# Altium project 3DAS_4Camera.PrjPcb (part 9 of 10)

## Sheet [15] 2ND_AP1302 ISP.SchDoc
size A3; DocumentNumber: 15; SheetNumber: 15; SheetTotal: 16
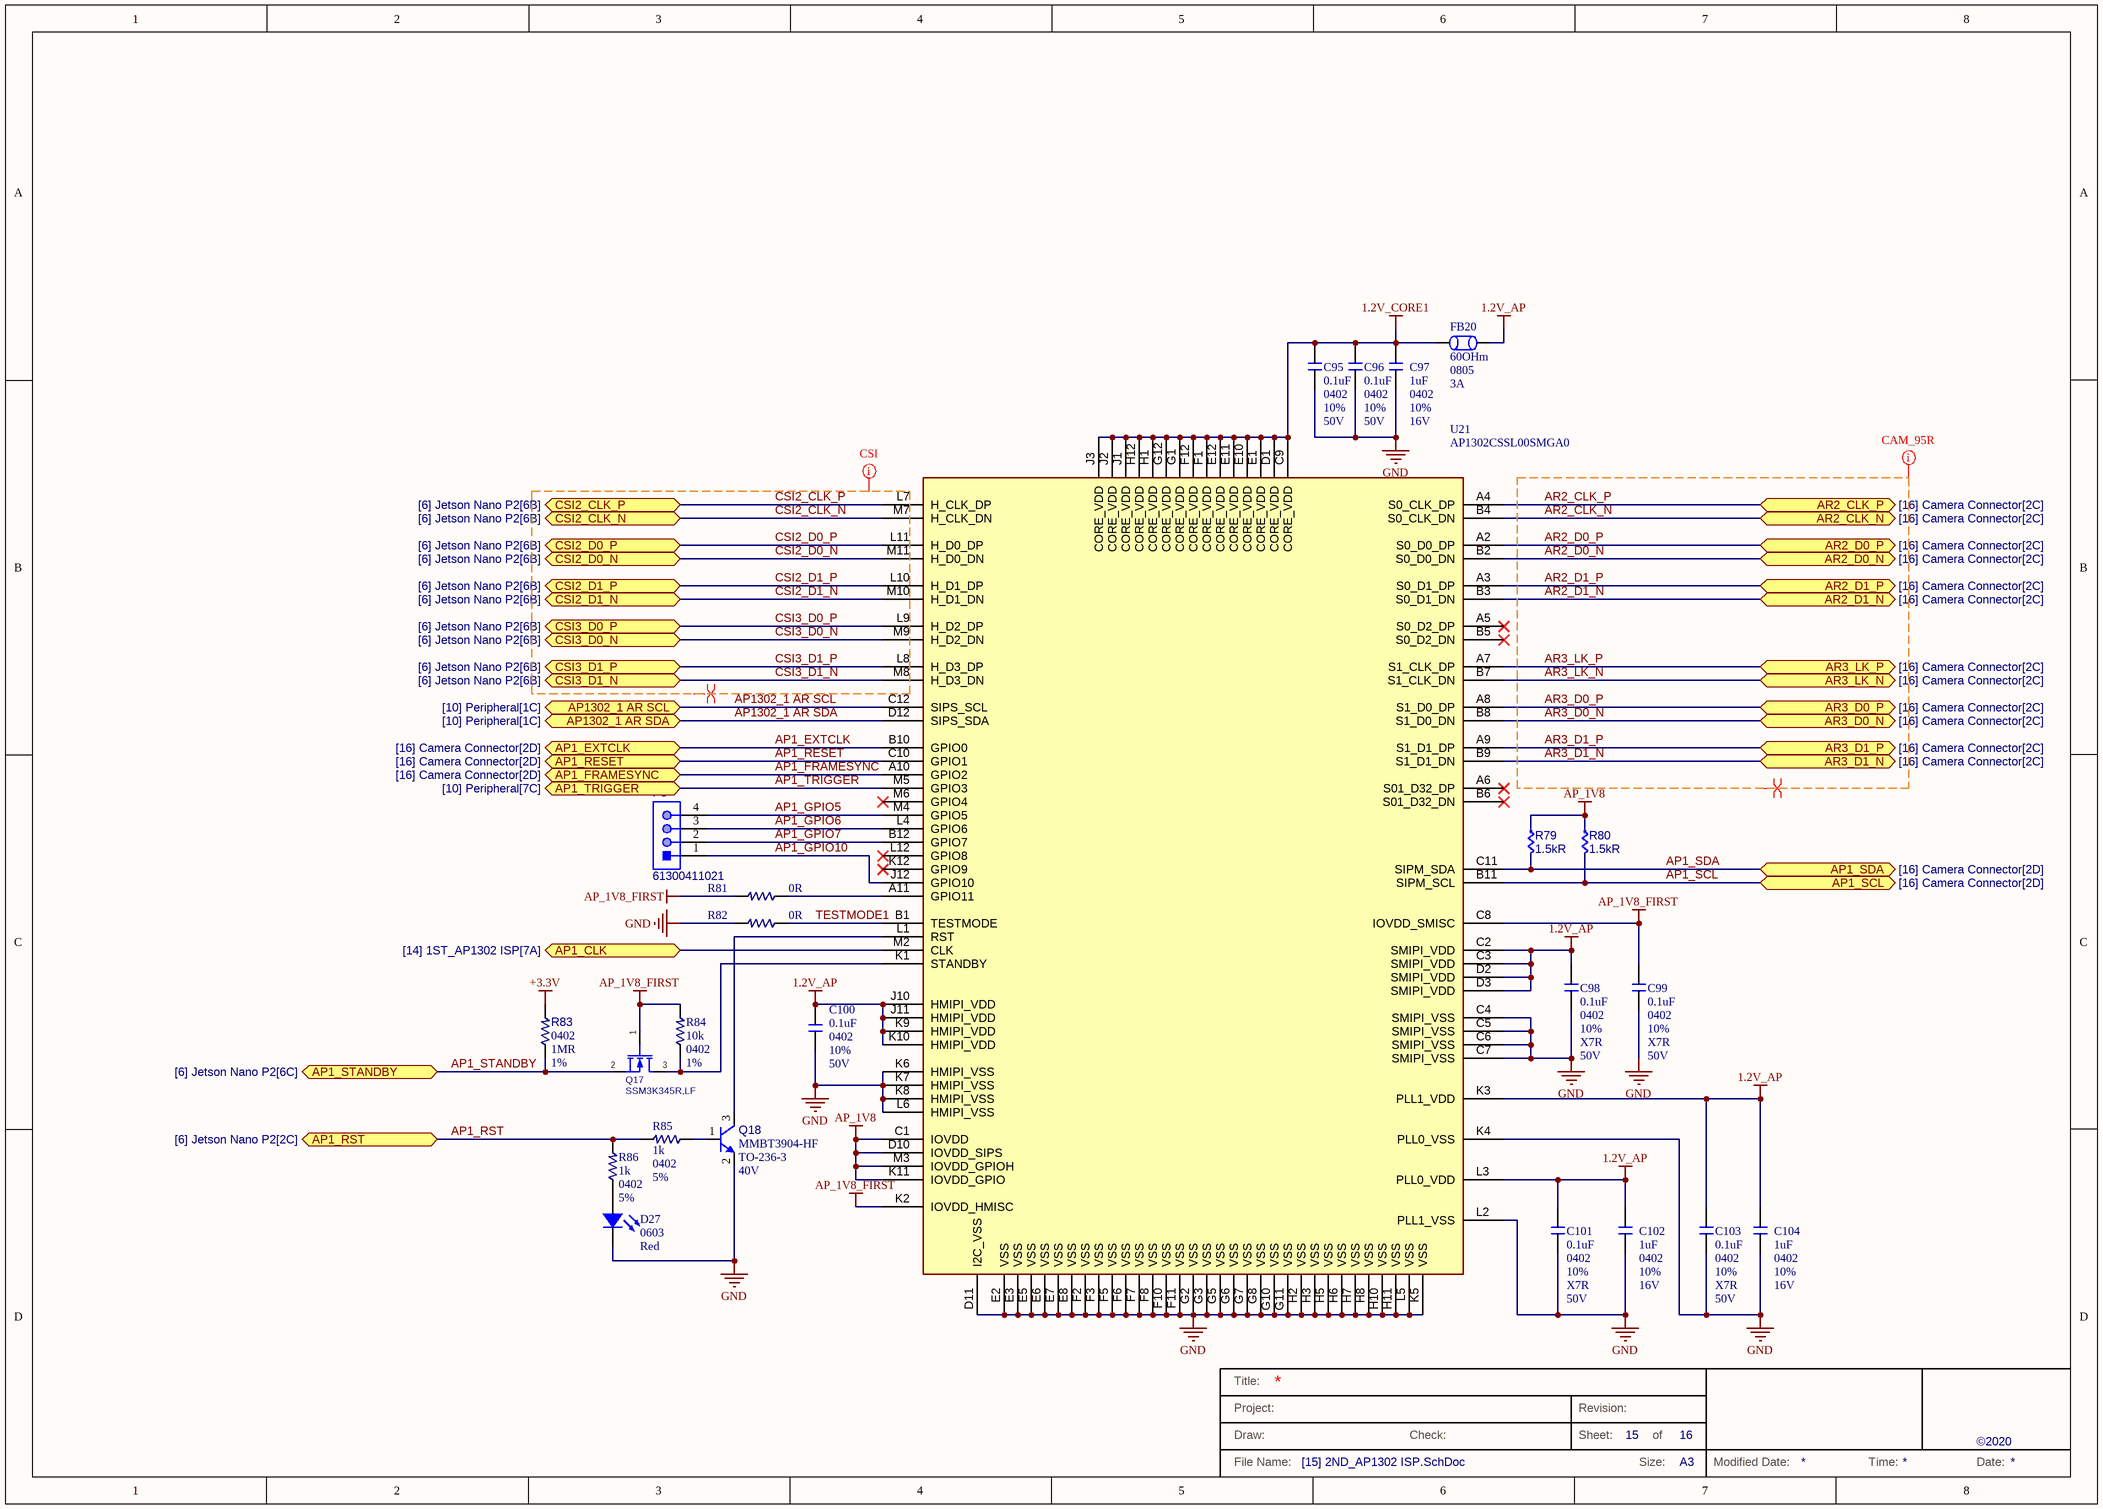
[diagram p14: [15] 2ND_AP1302 ISP.SchDoc]

### Parts
C95  0.1uF  Case/Package: 0402  Tolerance: 10%  Voltage: 50V  [C0402M]
C96  0.1uF  Case/Package: 0402  Tolerance: 10%  Voltage: 50V  [C0402M]
C97  1uF  Case Code (Imperial): 0402  Tolerance: 10%  Voltage: 16V  [C0402M]
C98  0.1uF  Case/Package: 0402  Tolerance: 10%  Dielectric: X7R  Voltage: 50V  [C0402M]
C99  0.1uF  Case/Package: 0402  Tolerance: 10%  Dielectric: X7R  Voltage: 50V  [C0402M]
C100  0.1uF  Case/Package: 0402  Tolerance: 10%  Voltage: 50V  [C0402M]
C101  0.1uF  Case/Package: 0402  Tolerance: 10%  Dielectric: X7R  Voltage: 50V  [C0402M]
C102  1uF  Case Code (Imperial): 0402  Tolerance: 10%  Voltage: 16V  [C0402M]
C103  0.1uF  Case/Package: 0402  Tolerance: 10%  Dielectric: X7R  Voltage: 50V  [C0402M]
C104  1uF  Case Code (Imperial): 0402  Tolerance: 10%  Voltage: 16V  [C0402M]
D27  Case/Package: 0603  Color: Red  [LED-0603]  (hidden comment: LTST-C190CKT)
FB20  60OHm  Case Code (Imperial): 0805  Max DC Current: 3A  [R0805M]
P8  61300411021  [61300411021]
Q17  SSM3K345R,LF  [SSM3K345R,LF-Footprint-1]
Q18  Manufacturer Part Number 1: MMBT3904-HF  Case/Package: TO-236-3  Collector Emitter Breakdown Voltage: 40V  [SOT55P160X90-3N]  (hidden comment: NPN)
R79  Resistance: 1.5kR  [RES0402]  (hidden comment: ERJ-2RKF1501X)
R80  Resistance: 1.5kR  [RES0402]  (hidden comment: ERJ-2RKF1501X)
R81  Resistance: 0R  [R0402M]  (hidden comment: RC0402FR-070RL)
R82  Resistance: 0R  [R0402M]  (hidden comment: RC0402FR-070RL)
R83  Case Code (Imperial): 0402  Resistance: 1MR  Tolerance: 1%  [R0402M]  (hidden comment: 1M)
R84  10k  Case Code (Imperial): 0402  Tolerance: 1%  [R0402M]
R85  1k  Case Code (Imperial): 0402  Tolerance: 5%  [R0402M]
R86  1k  Case Code (Imperial): 0402  Tolerance: 5%  [R0402M]
U21  AP1302CSSL00SMGA0  [AP1302CSSL00SMGA0]

### Ports
AP1_CLK (bidir, see [14] 1ST_AP1302 ISP[7A]), AP1_EXTCLK (bidir, see [16] Camera Connector[2D]), AP1_FRAMESYNC (bidir, see [16] Camera Connector[2D]), AP1_RESET (bidir, see [16] Camera Connector[2D]), AP1_RST (bidir, see [6] Jetson Nano P2[2C]), AP1_SCL (bidir, see [16] Camera Connector[2D]), AP1_SDA (bidir, see [16] Camera Connector[2D]), AP1_STANDBY (bidir, see [6] Jetson Nano P2[6C]), AP1_TRIGGER (bidir, see [10] Peripheral[7C]), AP1302_1 AR SCL (bidir, see [10] Peripheral[1C]), AP1302_1 AR SDA (bidir, see [10] Peripheral[1C]), AR2_CLK_N (bidir, see [16] Camera Connector[2C]), AR2_CLK_P (bidir, see [16] Camera Connector[2C]), AR2_D0_N (bidir, see [16] Camera Connector[2C]), AR2_D0_P (bidir, see [16] Camera Connector[2C]), AR2_D1_N (bidir, see [16] Camera Connector[2C]), AR2_D1_P (bidir, see [16] Camera Connector[2C]), AR3_D0_N (bidir, see [16] Camera Connector[2C]), AR3_D0_P (bidir, see [16] Camera Connector[2C]), AR3_D1_N (bidir, see [16] Camera Connector[2C]), AR3_D1_P (bidir, see [16] Camera Connector[2C]), AR3_LK_N (bidir, see [16] Camera Connector[2C]), AR3_LK_P (bidir, see [16] Camera Connector[2C]), CSI2_CLK_N (bidir, see [6] Jetson Nano P2[6B]), CSI2_CLK_P (bidir, see [6] Jetson Nano P2[6B]), CSI2_D0_N (bidir, see [6] Jetson Nano P2[6B]), CSI2_D0_P (bidir, see [6] Jetson Nano P2[6B]), CSI2_D1_N (bidir, see [6] Jetson Nano P2[6B]), CSI2_D1_P (bidir, see [6] Jetson Nano P2[6B]), CSI3_D0_N (bidir, see [6] Jetson Nano P2[6B]), CSI3_D0_P (bidir, see [6] Jetson Nano P2[6B]), CSI3_D1_N (bidir, see [6] Jetson Nano P2[6B]), CSI3_D1_P (bidir, see [6] Jetson Nano P2[6B])

### Nets
1.2V_AP: C98.1 C100.1 C101.1 C102.1 C103.1 C104.1 FB20.1 U21.C2(SMIPI_VDD) U21.C3(SMIPI_VDD) U21.D2(SMIPI_VDD) U21.D3(SMIPI_VDD) U21.J10(HMIPI_VDD) U21.J11(HMIPI_VDD) U21.K3(PLL1_VDD) U21.K9(HMIPI_VDD) U21.K10(HMIPI_VDD) U21.L3(PLL0_VDD)
1.2V_CORE1: C95.1 C96.1 C97.1 FB20.2 U21.C9(CORE_VDD) U21.D1(CORE_VDD) U21.E1(CORE_VDD) U21.E10(CORE_VDD) U21.E11(CORE_VDD) U21.E12(CORE_VDD) U21.F1(CORE_VDD) U21.F12(CORE_VDD) U21.G1(CORE_VDD) U21.G12(CORE_VDD) U21.H1(CORE_VDD) U21.H12(CORE_VDD) U21.J1(CORE_VDD) U21.J2(CORE_VDD) U21.J3(CORE_VDD)
+3.3V: R83.1
AP_1V8: R79.1 R80.1 U21.C1(IOVDD) U21.D10(IOVDD_SIPS) U21.K11(IOVDD_GPIO) U21.M3(IOVDD_GPIOH)
AP_1V8_FIRST: C99.1 Q17.1(G) R81.1 R84.1 U21.C8(IOVDD_SMISC) U21.K2(IOVDD_HMISC)
GND: C95.2 C96.2 C97.2 C98.2 C99.2 C100.2 C101.2 C102.2 C103.2 C104.2 D27.2(K) Q18.2(E) R82.1 U21.C4(SMIPI_VSS) U21.C5(SMIPI_VSS) U21.C6(SMIPI_VSS) U21.C7(SMIPI_VSS) U21.D11(I2C_VSS) U21.E2(VSS) U21.E3(VSS) U21.E5(VSS) U21.E6(VSS) U21.E7(VSS) U21.E8(VSS) U21.F2(VSS) U21.F3(VSS) U21.F5(VSS) U21.F6(VSS) U21.F7(VSS) U21.F8(VSS) U21.F10(VSS) U21.F11(VSS) U21.G2(VSS) U21.G3(VSS) U21.G5(VSS) U21.G6(VSS) U21.G7(VSS) U21.G8(VSS) U21.G10(VSS) U21.G11(VSS) U21.H2(VSS) U21.H3(VSS) U21.H5(VSS) U21.H6(VSS) U21.H7(VSS) U21.H8(VSS) U21.H10(VSS) U21.H11(VSS) U21.K4(PLL0_VSS) U21.K5(VSS) U21.K6(HMIPI_VSS) U21.K7(HMIPI_VSS) U21.K8(HMIPI_VSS) U21.L2(PLL1_VSS) U21.L5(VSS) U21.L6(HMIPI_VSS)
AP1_CLK: U21.M2(CLK) ; port AP1_CLK
AP1_EXTCLK: U21.B10(GPIO0) ; port AP1_EXTCLK
AP1_FRAMESYNC: U21.A10(GPIO2) ; port AP1_FRAMESYNC
AP1_GPIO5: P8.4 U21.M4(GPIO5)
AP1_GPIO6: P8.3 U21.L4(GPIO6)
AP1_GPIO7: P8.2 U21.B12(GPIO7)
AP1_GPIO10: P8.1 U21.J12(GPIO10)
AP1_RESET: U21.C10(GPIO1) ; port AP1_RESET
AP1_RST: R85.1 R86.1 ; port AP1_RST
AP1_SCL: R80.2 U21.B11(SIPM_SCL) ; port AP1_SCL
AP1_SDA: R79.2 U21.C11(SIPM_SDA) ; port AP1_SDA
AP1_STANDBY: Q17.2(S) R83.2 ; port AP1_STANDBY
AP1_TRIGGER: U21.M5(GPIO3) ; port AP1_TRIGGER
AP1302_1 AR SCL: U21.C12(SIPS_SCL) ; port AP1302_1 AR SCL
AP1302_1 AR SDA: U21.D12(SIPS_SDA) ; port AP1302_1 AR SDA
AR2_CLK_N: U21.B4(S0_CLK_DN) ; port AR2_CLK_N
AR2_CLK_P: U21.A4(S0_CLK_DP) ; port AR2_CLK_P
AR2_D0_N: U21.B2(S0_D0_DN) ; port AR2_D0_N
AR2_D0_P: U21.A2(S0_D0_DP) ; port AR2_D0_P
AR2_D1_N: U21.B3(S0_D1_DN) ; port AR2_D1_N
AR2_D1_P: U21.A3(S0_D1_DP) ; port AR2_D1_P
AR3_D0_N: U21.B8(S1_D0_DN) ; port AR3_D0_N
AR3_D0_P: U21.A8(S1_D0_DP) ; port AR3_D0_P
AR3_D1_N: U21.B9(S1_D1_DN) ; port AR3_D1_N
AR3_D1_P: U21.A9(S1_D1_DP) ; port AR3_D1_P
AR3_LK_N: U21.B7(S1_CLK_DN) ; port AR3_LK_N
AR3_LK_P: U21.A7(S1_CLK_DP) ; port AR3_LK_P
CSI2_CLK_N: U21.M7(H_CLK_DN) ; port CSI2_CLK_N
CSI2_CLK_P: U21.L7(H_CLK_DP) ; port CSI2_CLK_P
CSI2_D0_N: U21.M11(H_D0_DN) ; port CSI2_D0_N
CSI2_D0_P: U21.L11(H_D0_DP) ; port CSI2_D0_P
CSI2_D1_N: U21.M10(H_D1_DN) ; port CSI2_D1_N
CSI2_D1_P: U21.L10(H_D1_DP) ; port CSI2_D1_P
CSI3_D0_N: U21.M9(H_D2_DN) ; port CSI3_D0_N
CSI3_D0_P: U21.L9(H_D2_DP) ; port CSI3_D0_P
CSI3_D1_N: U21.M8(H_D3_DN) ; port CSI3_D1_N
CSI3_D1_P: U21.L8(H_D3_DP) ; port CSI3_D1_P
TESTMODE1: R82.2 U21.B1(TESTMODE)
NetD27_1: D27.1(A) R86.2
NetQ17_3: Q17.3(D) R84.2 U21.K1(STANDBY)
NetQ18_1: Q18.1(B) R85.2
NetQ18_3: Q18.3(C) U21.L1(RST)
NetR81_2: R81.2 U21.A11(GPIO11)

Not connected (* = marked no-connect by the designer): U21 A5(S0_D2_DP)* A6(S01_D32_DP)* B5(S0_D2_DN)* B6(S01_D32_DN)* K12(GPIO9)* L12(GPIO8)* M6(GPIO4)*

### Layout directives
net class CAM_95R: AR2_CLK_N, AR2_CLK_P, AR2_D0_N, AR2_D0_P, AR2_D1_N, AR2_D1_P, AR3_D0_N, AR3_D0_P, AR3_D1_N, AR3_D1_P, AR3_LK_N, AR3_LK_P
differential pair: AR2_CLK_N, AR2_CLK_P, AR2_D0_N, AR2_D0_P, AR2_D1_N, AR2_D1_P, AR3_D0_N, AR3_D0_P, AR3_D1_N, AR3_D1_P, AR3_LK_N, AR3_LK_P, CSI2_CLK_N, CSI2_CLK_P, CSI2_D0_N, CSI2_D0_P, CSI2_D1_N, CSI2_D1_P, CSI3_D0_N, CSI3_D0_P, CSI3_D1_N, CSI3_D1_P
net class CSI: CSI2_CLK_N, CSI2_CLK_P, CSI2_D0_N, CSI2_D0_P, CSI2_D1_N, CSI2_D1_P, CSI3_D0_N, CSI3_D0_P, CSI3_D1_N, CSI3_D1_P

### Notes on the sheet
- Title:
- Project:
- Draw:
- Check:
- Revision:
- Sheet:
- of
- ©2020
- File Name:
- Size:
- A3
- Modified Date:
- Time:
- Date:

### Library data of the parts
C95 C96 C98-C101 C103 = CAP_CER: CAP CER 0.1UF 50V X7R 0402; Manufacturer: Murata; Manufacturer Part Number: GRM155R71H104KE14D; Material: Ceramic; Capacitance: 100nF; Dissipation Factor: 0.025%; ComponentLink1URL: https://datasheet.ciiva.com/25741/cl10b104kb8nnnl-25741341.pdf?src-supplier=Digi-Key; ComponentLink1Description: https://datasheet.ciiva.com/25741/cl10b104kb8nnnl-25741341.pdf?src-supplier=Digi-Key; ComponentLink2URL: https://datasheet.ciiva.com/26838/getdatasheetpartid-357523-26838415.pdf?src-supplier=Verical; ComponentLink2Description: https://datasheet.ciiva.com/26838/getdatasheetpartid-357523-26838415.pdf?src-supplier=Verical; Supplier 1: Digi-Key; Supplier Part Number 1: 490-10700-1-ND; Stock 1: 2282266; Pricing 1: 1 = 0.10000, 10 = 0.04600, 100 = 0.02050, 500 = 0.01464, 1000 = 0.01150, 2500 = 0.01045, 5000 = 0.00961 (USD); RoHS: Yes; Mount: Surface Mount; Weight: 0.000212oz; Case Code (Metric): 1005; Case Code (Imperial): 0402; Dielectric Material: Ceramic; Min Operating Temperature: -55°C; Max Operating Temperature: 125°C; Packaging: Tape and Reel; Voltage Rating: 50V; Termination: SMD/SMT; Composition: Ceramic; Voltage Rating (DC): 50V; Package Quantity: 10000; Length: 1mm; Height: 0.5mm; Width: 0.5mm; Thickness: 0.022inch; Depth: 0.5mm; REACH SVHC: No SVHC; Lead Free: Lead Free; ComponentLink3URL: http://www.farnell.com/datasheets/2079156.pdf?src-supplier=Farnell; ComponentLink3Description: http://www.farnell.com/datasheets/2079156.pdf?src-supplier=Farnell; ComponentLink4URL: http://www.mouser.com/ds/2/281/c02e-2905.pdf?src-supplier=Mouser; ComponentLink4Description: http://www.mouser.com/ds/2/281/c02e-2905.pdf?src-supplier=Mouser; ComponentLink5URL: http://components.arrow.com/part/dataview/0323_07030614?src-supplier=Arrow+Europe; ComponentLink5Description: http://components.arrow.com/part/dataview/0323_07030614?src-supplier=Arrow+Europe; ComponentLink6URL: https://search.murata.co.jp/Ceramy/image/img/A01X/G101/ENG/GRM155R71H104KE14-01.pdf?src-supplier=Digi-Key; ComponentLink6Description: https://search.murata.co.jp/Ceramy/image/img/A01X/G101/ENG/GRM155R71H104KE14-01.pdf?src-supplier=Digi-Key; ComponentLink7URL: http://psearch.en.murata.com/capacitor/product/GRM155R71H104KE14%23.pdf?src-supplier=Avnet; ComponentLink7Description: http://psearch.en.murata.com/capacitor/product/GRM155R71H104KE14%23.pdf?src-supplier=Avnet; ComponentLink8URL: http://www.farnell.com/datasheets/2079156.pdf?src-supplier=Element14; ComponentLink8Description: http://www.farnell.com/datasheets/2079156.pdf?src-supplier=Element14; ComponentLink9URL: http://www.farnell.com/datasheets/2079156.pdf?src-supplier=Newark; ComponentLink9Description: http://www.farnell.com/datasheets/2079156.pdf?src-supplier=Newark
  C95 C96 C100: Dielectric: X7R
C97 C102 C104 = CAP_CER: SAMSUNG ELECTRO-MECHANICS - CL05A105KO5NNNC - SMD Multilayer Ceramic Capacitor, 1 µF, 16 V, 0402 [1005 Metric], ± 10%, X5R, CL Series; Supplier 1: Digi-Key; Supplier Part Number 1: 1276-1067-1-ND; Manufacturer 1: Samsung; Manufacturer Part Number 1: CL05A105KO5NNNC; Stock 1: 1039902; Pricing 1: 1=0.10000, 10=0.04600, 50=0.02520, 100=0.02050, 500=0.01466, 1000=0.01151, 2500=0.01046, 5000=0.00963 (USD); RoHS: Yes; Mount: Surface Mount; Case/Package: 0402; Case Code (Metric): 1005; Contact Plating: Tin; Min Operating Temperature: -55°C; Max Operating Temperature: 85°C; Capacitance: 1uF; Dielectric: X5R; Packaging: Tape and Reel; Package Quantity: 1; Voltage Rating: 16V; Series: CL; Construction: Flat; Length: 1mm; Width: 0.02inch; Height: 0.5mm; Thickness: 0.022inch; Depth: 0.5mm; Radiation Hardening: No; RoHS Compliant: Yes; ComponentLink1URL: https://datasheet.ciiva.com/16207/cl05a105ko5nnnc-16207571.pdf?src-supplier=Future+Electronics; ComponentLink1Description: https://datasheet.ciiva.com/16207/cl05a105ko5nnnc-16207571.pdf?src-supplier=Future+Electronics; ComponentLink2URL: https://datasheet.ciiva.com/15195/getdatasheetpartid-355272-15195629.pdf?src-supplier=Verical; ComponentLink2Description: https://datasheet.ciiva.com/15195/getdatasheetpartid-355272-15195629.pdf?src-supplier=Verical
D27 = Led: LED RED CLEAR CHIP SMD; Manufacturer 1: Vishay Lite-On; Lens Color: Colorless; Lens Style: Diffused,Colorless,Rectangular,Clear; Forward Voltage: 1.8V; Viewing Angle: 130°; Forward Current: 20mA; Luminous Intensity: 10mcd; Dominant Wavelength: 638nm; Test Current: 10mA; Number of Elements: 1; Power Dissipation: 62.5mW; Wavelength: 660nm; Reverse Voltage: 5V; Power Rating: 100mW; Supplier 1: Digi-Key; Supplier Part Number 1: 160-1181-1-ND; Manufacturer Part Number 1: LTST-C190CKT; RoHS: Yes; Category: LEDs; Stock 1: 143500; Pricing 1: 1=0.30000 (USD); Mount: Surface Mount; Number of Pins: 2; Case Code (Metric): 1608; Case Code (Imperial): 0603; Min Operating Temperature: -30°C; Max Operating Temperature: 85°C; Packaging: Tape and Reel; Package Quantity: 1; Illumination Color: Red; Lens Transparency: Clear; Number of LEDs: 1; Max Power Dissipation: 100mW; Length: 1.6mm; Width: 0.8mm; Height: 0.8mm; Depth: 0.8mm; Radiation Hardening: No; Lead Free: Lead Free; RoHS Compliant: Yes; ComponentLink1URL: https://datasheet.ciiva.com/2110/ltst-c190ckt-2110129.pdf?src-supplier=Digi-Key; ComponentLink1Description: https://datasheet.ciiva.com/2110/ltst-c190ckt-2110129.pdf?src-supplier=Digi-Key; ComponentLink2URL: https://datasheet.ciiva.com/15201/getdatasheetpartid-245581-15201387.pdf?src-supplier=Verical; ComponentLink2Description: https://datasheet.ciiva.com/15201/getdatasheetpartid-245581-15201387.pdf?src-supplier=Verical; ComponentLink3URL: https://datasheet.ciiva.com/11773/0900766b80dc029f-11773615.pdf?src-supplier=RSComponents; ComponentLink3Description: https://datasheet.ciiva.com/11773/0900766b80dc029f-11773615.pdf?src-supplier=RSComponents; ComponentLink4URL: https://datasheet.ciiva.com/12400/lite-on-ltst-c190ckt-187378-12400679.pdf?src-supplier=Mouser; ComponentLink4Description: https://datasheet.ciiva.com/12400/lite-on-ltst-c190ckt-187378-12400679.pdf?src-supplier=Mouser; ComponentLink5URL: https://datasheet.ciiva.com/16287/lite-on20ltst-c190ckt-16287002.pdf?src-supplier=Future+Electronics; ComponentLink5Description: https://datasheet.ciiva.com/16287/lite-on20ltst-c190ckt-16287002.pdf?src-supplier=Future+Electronics; ComponentLink6URL: https://datasheet.ciiva.com/2110/ltst-c190ckt-2110131.pdf?src-supplier=Digi-Key; ComponentLink6Description: https://datasheet.ciiva.com/2110/ltst-c190ckt-2110131.pdf?src-supplier=Digi-Key; ComponentLink7URL: https://datasheet.ciiva.com/2110/ltst-c190ckt-2110130.pdf?src-supplier=Digi-Key; ComponentLink7Description: https://datasheet.ciiva.com/2110/ltst-c190ckt-2110130.pdf?src-supplier=Digi-Key
FB20 = FB: TAIYO YUDEN - BKP2125HS600-T - Ferrite Bead, 0805 [2012 Metric], 60 ohm, 3 A, BKP Series, 0.025 ohm, ± 25%; Impedance: 60R; DC Resistance (DCR): 25mR; Test Frequency: 100MHz; Number of Lines: 1; Shielding: Unshielded; Supplier 1: Digi-Key; Supplier Part Number 1: 587-1932-1-ND; Manufacturer 1: Taiyo Yuden; Manufacturer Part Number 1: BKP2125HS600-T; Stock 1: 181157; Pricing 1: 1=0.12000, 10=0.09400, 25=0.08480, 50=0.06200, 100=0.05360, 250=0.04232, 500=0.03574, 1000=0.03010 (USD); RoHS: Yes; Mount: Surface Mount; Case/Package: 0805; Number of Pins: 2; Core Material: Ferrite; Case Code (Metric): 2125; Min Operating Temperature: -55°C; Max Operating Temperature: 85°C; Tolerance: 25%; Packaging: Tape and Reel; Package Quantity: 1; Termination: SMD/SMT; Max Current Rating: 3A; Resistance: 25mR; Series: BK; Length: 2.3mm; Width: 0.049inch; Height: 1.05mm; Depth: 1.45mm; RoHS Compliant: Yes; Lead Free: Lead Free; Halogen Free: Halogen Free; REACH SVHC: Unknown; ComponentLink1URL: https://datasheet.ciiva.com/6213/bkp2125hs600-t-ss-6213090.pdf?src-supplier=Digi-Key; ComponentLink1Description: https://datasheet.ciiva.com/6213/bkp2125hs600-t-ss-6213090.pdf?src-supplier=Digi-Key; ComponentLink2URL: https://datasheet.ciiva.com/30063/884bkp2125hs600-t-30063956.pdf?src-supplier=Onlinecomponents.com; ComponentLink2Description: https://datasheet.ciiva.com/30063/884bkp2125hs600-t-30063956.pdf?src-supplier=Onlinecomponents.com; ComponentLink3URL: https://datasheet.ciiva.com/6213/mlci08-e-6213094.pdf?src-supplier=Digi-Key; ComponentLink3Description: https://datasheet.ciiva.com/6213/mlci08-e-6213094.pdf?src-supplier=Digi-Key; ComponentLink4URL: https://datasheet.ciiva.com/6213/mlci08-e-6213097.pdf?src-supplier=Digi-Key; ComponentLink4Description: https://datasheet.ciiva.com/6213/mlci08-e-6213097.pdf?src-supplier=Digi-Key
P8 = WE-CN-1P-M-R4: CONN HEADER R/A 4POS 2.54MM; Manufacturer: Würth Elektronik GmbH; Manufacturer Part Number: 61300411021; Supplier 1: RSComponents; Supplier Part Number 1: 8281658
Q17 = CMP-00698-1: MOSFET N-CHANNEL 20V 4A SOT23F; Manufacturer 1: Toshiba Semiconductor and Storage; Manufacturer Part Number 1: SSM3K345R,LF
Q18 = NPN: TRANS NPN 40V 0.2A SOT523; Manufacturer 1: Comchip; Collector Emitter Voltage (VCEO): 300mV; Max Collector Current: 200mA; Max Power Dissipation: 200mW; Transition Frequency: 300MHz; Element Configuration: Single; Collector Base Voltage (VCBO): 60V; Emitter Base Voltage (VEBO): 6V; Supplier 1: Digi-Key; Supplier Part Number 1: 641-1683-1-ND; Stock 1: 63354; Pricing 1: 1=0.19000, 10=0.17600, 100=0.09590, 500=0.05900, 1000=0.04023 (USD); RoHS: Yes; Mount: Surface Mount; Min Operating Temperature: -55°C; Max Operating Temperature: 150°C; Packaging: Tape and Reel; Package Quantity: 3000; Polarity: NPN; Collector Emitter Saturation Voltage: 300mV; Gain Bandwidth Product: 300MHz; Continuous Collector Current: 200mA; Collector-emitter Voltage-Max: 300mV; Series: -; Max Breakdown Voltage: 40V; RoHS Compliant: Yes; ComponentLink1URL: https://datasheet.ciiva.com/12075/mmbt3904-hf20reva265354-44540-12075939.pdf?src-supplier=Mouser; ComponentLink1Description: https://datasheet.ciiva.com/12075/mmbt3904-hf20reva265354-44540-12075939.pdf?src-supplier=Mouser; ComponentLink2URL: https://datasheet.ciiva.com/2957/mmbt3904-hf20reva265354-2957612.pdf?src-supplier=Digi-Key; ComponentLink2Description: https://datasheet.ciiva.com/2957/mmbt3904-hf20reva265354-2957612.pdf?src-supplier=Digi-Key
R79 R80 = CMP-00609-2: RES SMD 1.5K OHM 1% 1/10W 0402; Manufacturer 1: Panasonic Electronic Components; Voltage Rating: 50V; Temperature Coefficient: 100ppm/°C; Power Rating: 100mW; Width: 0.02inch; Max Operating Temperature: 155°C; Number of Pins: 2; Contact Plating: Tin; Case Code (Imperial): 0402; Features: Automotive AEC-Q200; Mount: Surface Mount; Depth: 0.5mm; Package Quantity: 1; Composition: Thick Film; Tolerance: 1%; Voltage Rating (DC): 50V; Manufacturer Part Number 1: ERJ-2RKF1501X; REACH SVHC: No SVHC; Max Power Dissipation: 100mW; Length: 1mm; Military Standard: Not; Case Code (Metric): 1005; Number of Terminations: 2; Case/Package: 0402; Lead Free: Lead Free; Min Operating Temperature: -55°C; Height: 0.35mm; Termination: SMD/SMT; Packaging: Tape and Reel; Radiation Hardening: No
R81 R82 = RES_SMD: RC Series 0402 0.063 W 0 Ohm Jumper Surface Mount Thick Film Chip Resistor; Manufacturer 1: Yageo; Tolerance: 1%; Power Rating: 62.5mW; Voltage Rating: 50V; Temperature Coefficient: 200ppm/°C; Max Power Dissipation: 63mW; Supplier 1: Digi-Key; Supplier Part Number 1: 311-0.0LRCT-ND; Manufacturer Part Number 1: RC0402FR-070RL; Stock 1: 2177900; Pricing 1: 1=0.10000, 10=0.01200, 25=0.00840, 50=0.00640, 100=0.00470, 250=0.00360, 500=0.00288, 1000=0.00212, 5000=0.00152 (USD); RoHS: Yes; Mount: Surface Mount; Case/Package: 0402; Contact Plating: Tin,Matte; Case Code (Imperial): 0402; Case Code (Metric): 1005; Size Code: 0402; Min Operating Temperature: -55°C; Max Operating Temperature: 155°C; Resistor Type: Thick Film; Packaging: Tape and Reel; Termination: SMD/SMT; Features: Moisture Resistant; Series: RC; Number of Terminations: 2; Length: 1mm; Width: 0.5mm; Height: 0.35mm; Radiation Hardening: No; Lead Free: Lead Free; RoHS Compliant: Yes; ComponentLink1URL: https://datasheet.ciiva.com/8896/pyu-rc0402-51-rohs-l-6-8896149.pdf?src-supplier=Avnet; ComponentLink1Description: https://datasheet.ciiva.com/8896/pyu-rc0402-51-rohs-l-6-8896149.pdf?src-supplier=Avnet; ComponentLink2URL: https://datasheet.ciiva.com/16790/pyu-rc0402-51-rohs-l-6-r-16790444.pdf?src-supplier=Future+Electronics; ComponentLink2Description: https://datasheet.ciiva.com/16790/pyu-rc0402-51-rohs-l-6-r-16790444.pdf?src-supplier=Future+Electronics; ComponentLink3URL: https://datasheet.ciiva.com/28419/pyu-rc0402-51-rohs-l-6-28419661.pdf?src-supplier=Avnet+Europe; ComponentLink3Description: https://datasheet.ciiva.com/28419/pyu-rc0402-51-rohs-l-6-28419661.pdf?src-supplier=Avnet+Europe; ComponentLink4URL: https://datasheet.ciiva.com/16869/pyu-rc0402-51-rohs-l-6-16869518.pdf?src-supplier=Avnet+Europe; ComponentLink4Description: https://datasheet.ciiva.com/16869/pyu-rc0402-51-rohs-l-6-16869518.pdf?src-supplier=Avnet+Europe
R83 = RES_SMD_17: RES SMD 1M OHM 1% 1/16W 0402; Manufacturer: Yageo; Manufacturer Part Number: RC0402FR-071ML; Power Rating: 63mW; Voltage Rating: 50V; Temperature Coefficient: 100ppm/°C; Supplier 1: Digi-Key; Supplier Part Number 1: 311-1.00MLRCT-ND; Stock 1: 5211374; Pricing 1: 1 = 0.10000, 10 = 0.01400, 100 = 0.00580, 1000 = 0.00260, 2500 = 0.00226, 5000 = 0.00186 (USD); RoHS: Yes; Case/Package: 0402; Case Code (Metric): 1005; Min Operating Temperature: -55°C; Max Operating Temperature: 155°C; Resistor Type: Thick Film; Packaging: Tape and Reel; Termination: SMD/SMT; Length: 1mm; Height: 0.32mm; Depth: 0.5mm; REACH SVHC: Unknown; Military Standard: Not; Lead Free: Lead Free; ComponentLink1URL: https://datasheet.ciiva.com/11808/0900766b80c66297-11808125.pdf?src-supplier=RSComponents; ComponentLink1Description: https://datasheet.ciiva.com/11808/0900766b80c66297-11808125.pdf?src-supplier=RSComponents; ComponentLink2URL: https://datasheet.ciiva.com/46394/1018594-46394951.pdf?src-supplier=Element14; ComponentLink2Description: https://datasheet.ciiva.com/46394/1018594-46394951.pdf?src-supplier=Element14; ComponentLink3URL: https://datasheet.ciiva.com/16741/pyu-rc0402-51-rohs-l-6-r-16741081.pdf?src-supplier=Future+Electronics; ComponentLink3Description: https://datasheet.ciiva.com/16741/pyu-rc0402-51-rohs-l-6-r-16741081.pdf?src-supplier=Future+Electronics; ComponentLink4URL: https://datasheet.ciiva.com/7849/1018594-7849882.pdf?src-supplier=Element14; ComponentLink4Description: https://datasheet.ciiva.com/7849/1018594-7849882.pdf?src-supplier=Element14; ComponentLink5URL: https://datasheet.ciiva.com/7849/1018594-7849883.pdf?src-supplier=Element14; ComponentLink5Description: https://datasheet.ciiva.com/7849/1018594-7849883.pdf?src-supplier=Element14
R84 = RES_SMD: RES SMD 10K OHM 1% 1/16W 0402; Manufacturer: Yageo; Manufacturer Part Number: RC0402FR-0710KL; Resistance: 10kR; Temperature Coefficient: 100ppm/°C; Voltage Rating (DC): 50V; Power Rating: 62.5mW; Supplier 1: Digi-Key; Supplier Part Number 1: 311-10.0KLRTR-ND; Stock 1: 58760000; Pricing 1: 10000 = 0.001630, 30000 = 0.001440, 50000 = 0.001320, 100000 = 0.001290 (USD); RoHS: Yes; Case/Package: 0402; Number of Pins: 2; Case Code (Metric): 1005; Min Operating Temperature: -55°C; Max Operating Temperature: 155°C; Composition: Thick Film; Packaging: Tape and Reel; Voltage Rating: 50V; Termination: SMD/SMT; Military Standard: Not; Working Voltage: 50V; Number of Terminations: 2; Length: 1mm; Height: 0.32mm; Width: 0.5mm; Depth: 0.5mm; Lead Pitch: 0.2mm; REACH SVHC: No SVHC; Lead Free: Lead Free; ComponentLink1URL: https://datasheet.ciiva.com/7660/38568-7660787.pdf?src-supplier=Element14; ComponentLink1Description: https://datasheet.ciiva.com/7660/38568-7660787.pdf?src-supplier=Element14; ComponentLink2URL: https://datasheet.ciiva.com/7849/1784430-7849813.pdf?src-supplier=Element14; ComponentLink2Description: https://datasheet.ciiva.com/7849/1784430-7849813.pdf?src-supplier=Element14; ComponentLink3URL: https://datasheet.ciiva.com/7849/1686128-7849814.pdf?src-supplier=Element14; ComponentLink3Description: https://datasheet.ciiva.com/7849/1686128-7849814.pdf?src-supplier=Element14; ComponentLink4URL: https://datasheet.ciiva.com/7849/1784430-7849815.pdf?src-supplier=Element14; ComponentLink4Description: https://datasheet.ciiva.com/7849/1784430-7849815.pdf?src-supplier=Element14; ComponentLink5URL: https://datasheet.ciiva.com/22747/1018594-22747512.pdf?src-supplier=Element14; ComponentLink5Description: https://datasheet.ciiva.com/22747/1018594-22747512.pdf?src-supplier=Element14; ComponentLink6URL: https://datasheet.ciiva.com/12667/pyu-rc0402-51-rohs-l-6-r-12667067.pdf?src-supplier=Mouser; ComponentLink6Description: https://datasheet.ciiva.com/12667/pyu-rc0402-51-rohs-l-6-r-12667067.pdf?src-supplier=Mouser; ComponentLink7URL: https://datasheet.ciiva.com/7983/1018594-7983486.pdf?src-supplier=Element14; ComponentLink7Description: https://datasheet.ciiva.com/7983/1018594-7983486.pdf?src-supplier=Element14
R85 R86 = RES_SMD: RES SMD 1K OHM 5% 1/16W 0402; Manufacturer: Yageo; Manufacturer Part Number: RC0402JR-071KL; Resistance: 1kR; Power Rating: 62.5mW; Voltage Rating: 50V; Temperature Coefficient: 100ppm/°C; Max Power Dissipation: 63mW; ComponentLink1URL: https://datasheet.ciiva.com/16855/pyu-rc0201-51-rohs-l-8-16855270.pdf?src-supplier=Avnet+Europe; ComponentLink1Description: https://datasheet.ciiva.com/16855/pyu-rc0201-51-rohs-l-8-16855270.pdf?src-supplier=Avnet+Europe; ComponentLink2URL: https://datasheet.ciiva.com/7672/1563626-7672265.pdf?src-supplier=Element14; ComponentLink2Description: https://datasheet.ciiva.com/7672/1563626-7672265.pdf?src-supplier=Element14; ComponentLink3URL: https://datasheet.ciiva.com/7660/1421516-7660811.pdf?src-supplier=Element14; ComponentLink3Description: https://datasheet.ciiva.com/7660/1421516-7660811.pdf?src-supplier=Element14; ComponentLink4URL: https://datasheet.ciiva.com/46391/1421516-46391293.pdf?src-supplier=Element14; ComponentLink4Description: https://datasheet.ciiva.com/46391/1421516-46391293.pdf?src-supplier=Element14; ComponentLink5URL: https://datasheet.ciiva.com/2462/pyu-r-int-thick-7-2462830.pdf?src-supplier=Digi-Key; ComponentLink5Description: https://datasheet.ciiva.com/2462/pyu-r-int-thick-7-2462830.pdf?src-supplier=Digi-Key; ComponentLink6URL: https://datasheet.ciiva.com/2462/pyu-r-int-thick-7-2462831.pdf?src-supplier=Digi-Key; ComponentLink6Description: https://datasheet.ciiva.com/2462/pyu-r-int-thick-7-2462831.pdf?src-supplier=Digi-Key; ComponentLink7URL: https://datasheet.ciiva.com/8896/pyu-rc0201-51-rohs-l-8-8896175.pdf?src-supplier=Avnet; ComponentLink7Description: https://datasheet.ciiva.com/8896/pyu-rc0201-51-rohs-l-8-8896175.pdf?src-supplier=Avnet; ComponentLink8URL: https://datasheet.ciiva.com/28419/pyu-rc0201-51-rohs-l-8-28419638.pdf?src-supplier=Avnet+Europe; ComponentLink8Description: https://datasheet.ciiva.com/28419/pyu-rc0201-51-rohs-l-8-28419638.pdf?src-supplier=Avnet+Europe; ComponentLink9URL: https://datasheet.ciiva.com/7672/1563626-7672264.pdf?src-supplier=Element14; ComponentLink9Description: https://datasheet.ciiva.com/7672/1563626-7672264.pdf?src-supplier=Element14; ComponentLink10URL: https://datasheet.ciiva.com/2462/pyu-r-int-thick-7-2462829.pdf?src-supplier=Digi-Key; ComponentLink10Description: https://datasheet.ciiva.com/2462/pyu-r-int-thick-7-2462829.pdf?src-supplier=Digi-Key; Supplier 1: Digi-Key; Supplier Part Number 1: 311-1.0KJRCT-ND; Stock 1: 0; Pricing 1: 1 = 0.10000, 10 = 0.01300, 100 = 0.00530, 1000 = 0.00236, 2500 = 0.00205, 5000 = 0.00169 (USD); RoHS: Yes; Case/Package: 0402; Case Code (Metric): 1005; Min Operating Temperature: -55°C; Max Operating Temperature: 155°C; Packaging: Tape and Reel; Package Quantity: 1; Termination: SMD/SMT; Composition: Thick Film; Number of Terminations: 2; Military Standard: Not; Features: Moisture Resistant; Length: 0.039inch; Height: 0.016inch; Width: 0.02inch; Depth: 0.5mm; REACH SVHC: No SVHC; Lead Free: Lead Free; ComponentLink11URL: https://datasheet.ciiva.com/2452/pyu-r-int-thick-7-2452755.pdf?src-supplier=Digi-Key; ComponentLink11Description: https://datasheet.ciiva.com/2452/pyu-r-int-thick-7-2452755.pdf?src-supplier=Digi-Key; ComponentLink12URL: https://datasheet.ciiva.com/2452/pyu-r-int-thick-7-2452756.pdf?src-supplier=Digi-Key; ComponentLink12Description: https://datasheet.ciiva.com/2452/pyu-r-int-thick-7-2452756.pdf?src-supplier=Digi-Key; ComponentLink13URL: https://datasheet.ciiva.com/2452/pyu-r-int-thick-7-2452757.pdf?src-supplier=Digi-Key; ComponentLink13Description: https://datasheet.ciiva.com/2452/pyu-r-int-thick-7-2452757.pdf?src-supplier=Digi-Key; ComponentLink14URL: https://datasheet.ciiva.com/7983/1018594-7983558.pdf?src-supplier=Element14; ComponentLink14Description: https://datasheet.ciiva.com/7983/1018594-7983558.pdf?src-supplier=Element14; ComponentLink15URL: https://datasheet.ciiva.com/7850/1018594-7850170.pdf?src-supplier=Element14; ComponentLink15Description: https://datasheet.ciiva.com/7850/1018594-7850170.pdf?src-supplier=Element14; ComponentLink16URL: https://datasheet.ciiva.com/7850/1018594-7850171.pdf?src-supplier=Element14; ComponentLink16Description: https://datasheet.ciiva.com/7850/1018594-7850171.pdf?src-supplier=Element14; ComponentLink17URL: https://datasheet.ciiva.com/17081/pyu-rc0402-51-rohs-l-6-r-17081438.pdf?src-supplier=Future+Electronics; ComponentLink17Description: https://datasheet.ciiva.com/17081/pyu-rc0402-51-rohs-l-6-r-17081438.pdf?src-supplier=Future+Electronics
U21 = AP1302: IMAGE SENSOR 13 MP CO-PROCESSOR; Manufacturer: ON Semiconductor; Manufacturer Part Number: AP1302CSSL00SMGA0-DR; Supplier 1: Mouser; RoHS: Yes; Category: Optoelectronics; Stock 1: 3840; Pricing 1: 3840=6.59000, 10000=6.59000 (USD); Mount: Surface Mount; Packaging: Tray; Lead Free: Lead Free; ComponentLink1URL: http://www.onsemi.com/PowerSolutions/product.do?id=AP1302&pdf=Y&src-supplier=Avnet; ComponentLink1Description: http://www.onsemi.com/PowerSolutions/product.do?id=AP1302&pdf=Y&src-supplier=Avnet; Supplier Part Number 1: 863-AP1302CSSL00SMDR

## Sheet [16] Camera Connector.SchDoc
size A3; DocumentNumber: 16; SheetNumber: 16; SheetTotal: 16
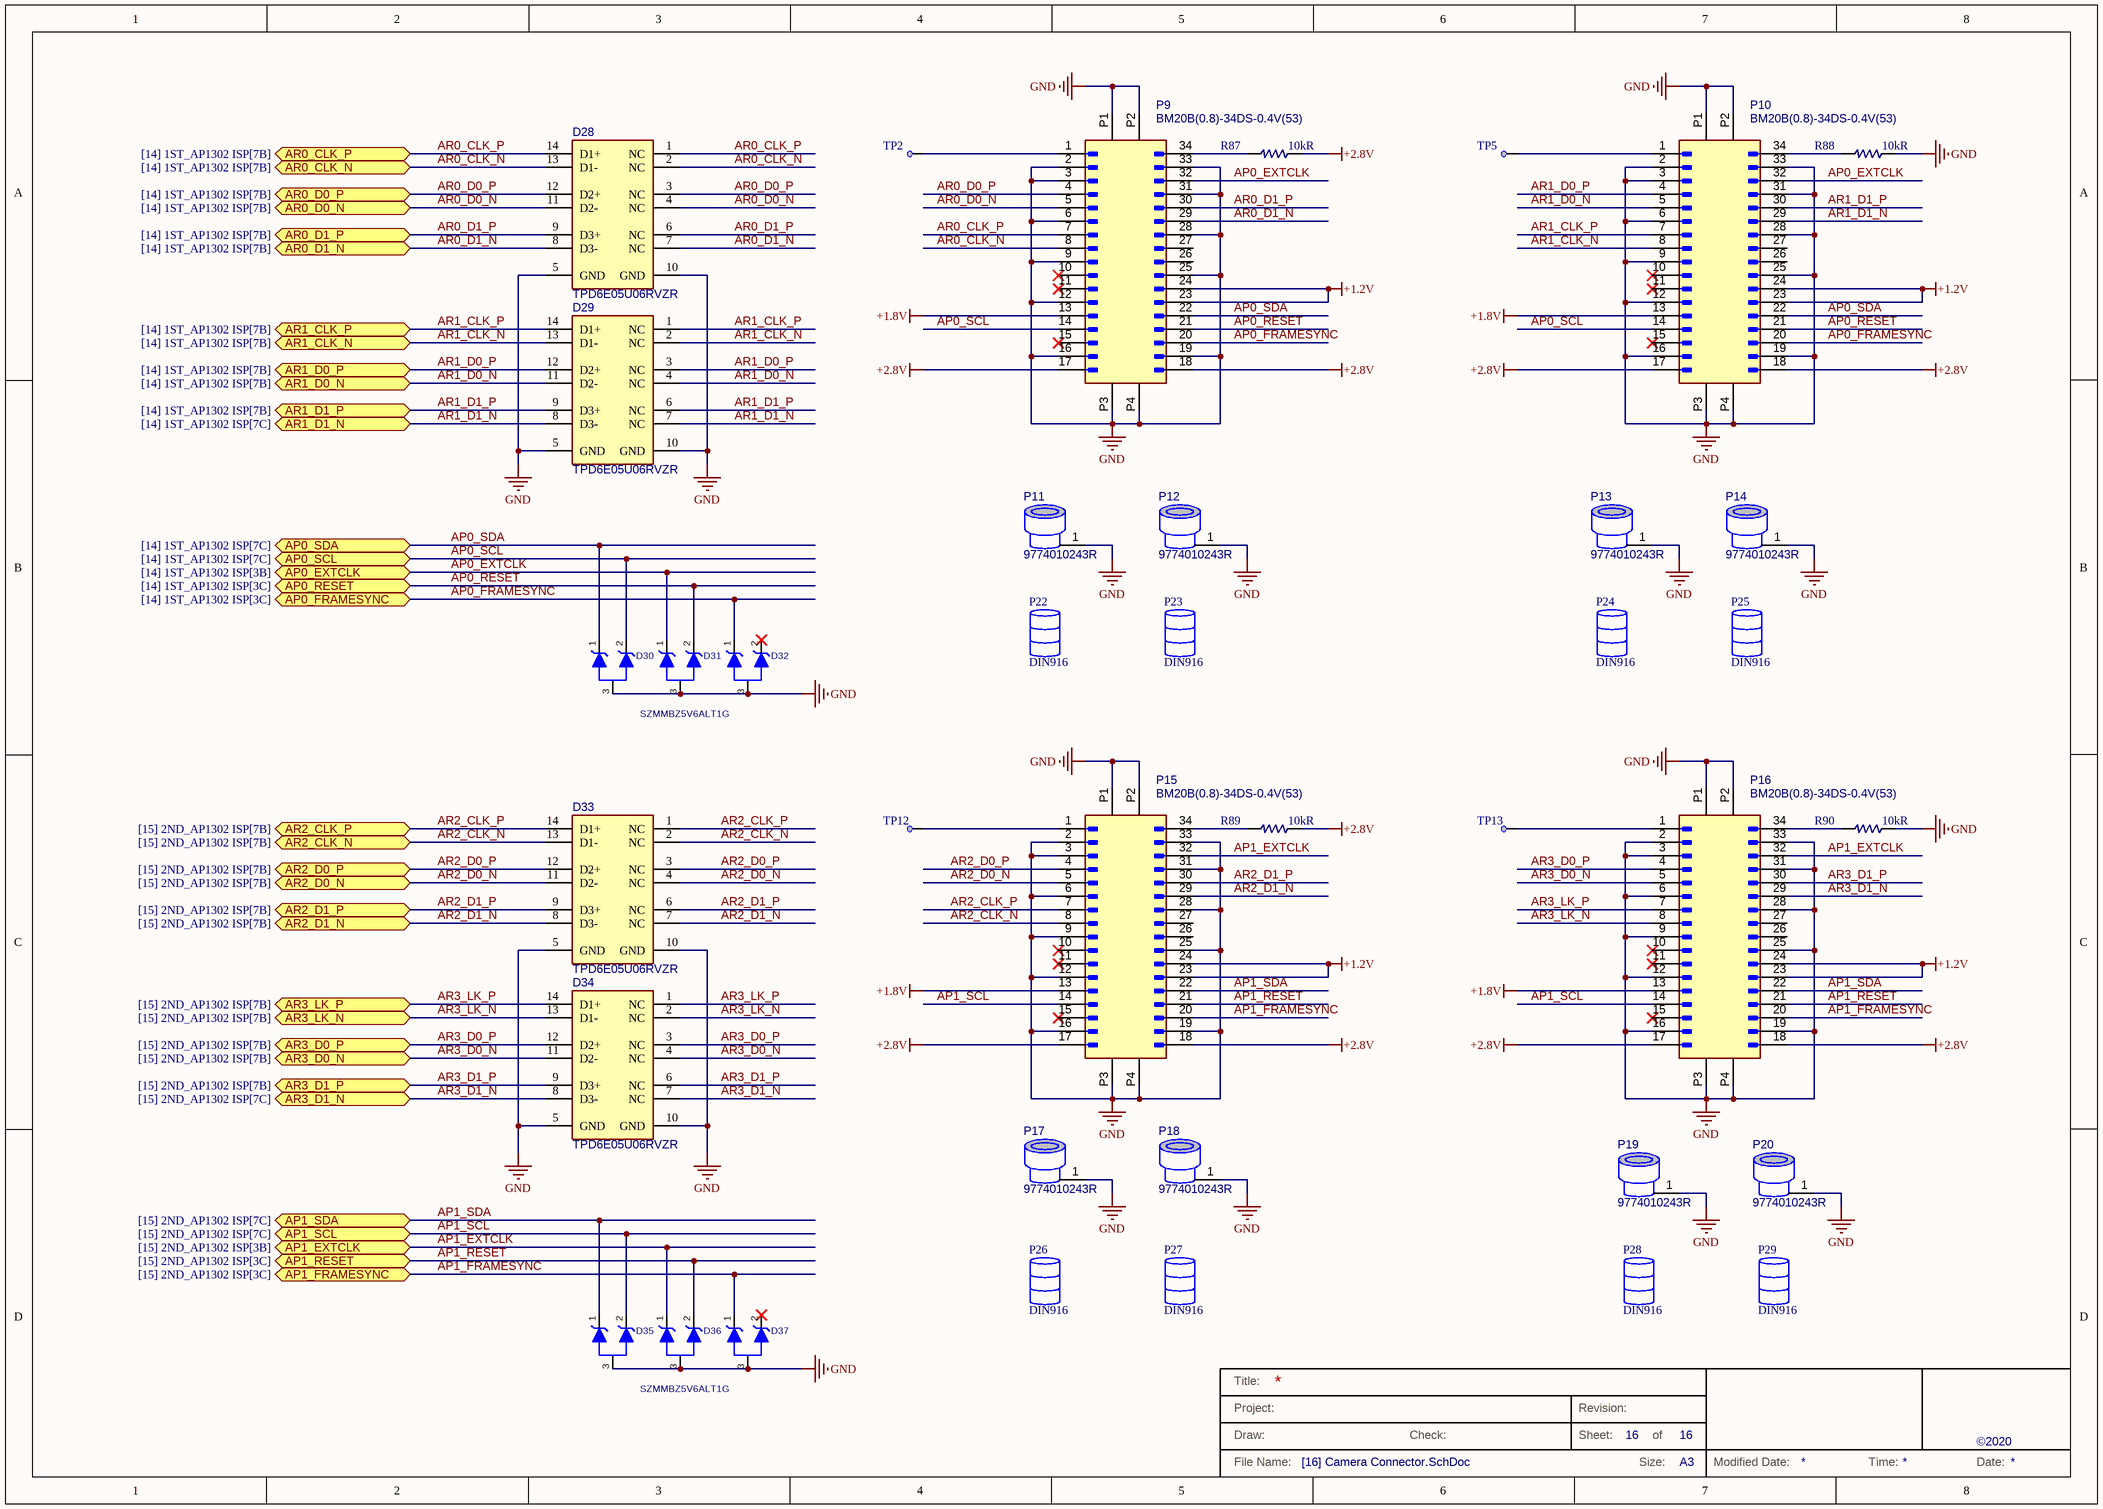
[diagram p15: [16] Camera Connector.SchDoc]

### Parts
D28  TPD6E05U06RVZR  [TPD6E05U06RVZR]
D29  TPD6E05U06RVZR  [TPD6E05U06RVZR]
D30  SZMMBZ5V6ALT1G  [ONSC-SOT-23-3-318-08_V]
D31  SZMMBZ5V6ALT1G  [ONSC-SOT-23-3-318-08_V]  (value not drawn)
D32  SZMMBZ5V6ALT1G  [ONSC-SOT-23-3-318-08_V]  (value not drawn)
D33  TPD6E05U06RVZR  [TPD6E05U06RVZR]
D34  TPD6E05U06RVZR  [TPD6E05U06RVZR]
D35  SZMMBZ5V6ALT1G  [ONSC-SOT-23-3-318-08_V]
D36  SZMMBZ5V6ALT1G  [ONSC-SOT-23-3-318-08_V]  (value not drawn)
D37  SZMMBZ5V6ALT1G  [ONSC-SOT-23-3-318-08_V]  (value not drawn)
P9  BM20B(0.8)-34DS-0.4V(53)  [BM20B(0.8)-34DS-0.4V(51)]
P10  BM20B(0.8)-34DS-0.4V(53)  [BM20B(0.8)-34DS-0.4V(51)]
P11  9774010243R  [WE_9774010243R]
P12  9774010243R  [WE_9774010243R]
P13  9774010243R  [WE_9774010243R]
P14  9774010243R  [WE_9774010243R]
P15  BM20B(0.8)-34DS-0.4V(53)  [BM20B(0.8)-34DS-0.4V(51)]
P16  BM20B(0.8)-34DS-0.4V(53)  [BM20B(0.8)-34DS-0.4V(51)]
P17  9774010243R  [WE_9774010243R]
P18  9774010243R  [WE_9774010243R]
P19  9774010243R  [WE_9774010243R]
P20  9774010243R  [WE_9774010243R]
P22  DIN916  [DIN916]
P23  DIN916  [DIN916]
P24  DIN916  [DIN916]
P25  DIN916  [DIN916]
P26  DIN916  [DIN916]
P27  DIN916  [DIN916]
P28  DIN916  [DIN916]
P29  DIN916  [DIN916]
R87  Resistance: 10kR  [R0402M]  (hidden comment: 10k)
R88  Resistance: 10kR  [R0402M]  (hidden comment: 10k)
R89  Resistance: 10kR  [R0402M]  (hidden comment: 10k)
R90  Resistance: 10kR  [R0402M]  (hidden comment: 10k)
TP2  TP  [Test point]  (value not drawn)  (net tie, no BOM)
TP5  TP  [Test point]  (value not drawn)  (net tie, no BOM)
TP12  TP  [Test point]  (value not drawn)  (net tie, no BOM)
TP13  TP  [Test point]  (value not drawn)  (net tie, no BOM)

### Ports
AP0_EXTCLK (bidir, see [14] 1ST_AP1302 ISP[3B]), AP0_FRAMESYNC (bidir, see [14] 1ST_AP1302 ISP[3C]), AP0_RESET (bidir, see [14] 1ST_AP1302 ISP[3C]), AP0_SCL (bidir, see [14] 1ST_AP1302 ISP[7C]), AP0_SDA (bidir, see [14] 1ST_AP1302 ISP[7C]), AP1_EXTCLK (bidir, see [15] 2ND_AP1302 ISP[3B]), AP1_FRAMESYNC (bidir, see [15] 2ND_AP1302 ISP[3C]), AP1_RESET (bidir, see [15] 2ND_AP1302 ISP[3C]), AP1_SCL (bidir, see [15] 2ND_AP1302 ISP[7C]), AP1_SDA (bidir, see [15] 2ND_AP1302 ISP[7C]), AR0_CLK_N (bidir, see [14] 1ST_AP1302 ISP[7B]), AR0_CLK_P (bidir, see [14] 1ST_AP1302 ISP[7B]), AR0_D0_N (bidir, see [14] 1ST_AP1302 ISP[7B]), AR0_D0_P (bidir, see [14] 1ST_AP1302 ISP[7B]), AR0_D1_N (bidir, see [14] 1ST_AP1302 ISP[7B]), AR0_D1_P (bidir, see [14] 1ST_AP1302 ISP[7B]), AR1_CLK_N (bidir, see [14] 1ST_AP1302 ISP[7B]), AR1_CLK_P (bidir, see [14] 1ST_AP1302 ISP[7B]), AR1_D0_N (bidir, see [14] 1ST_AP1302 ISP[7B]), AR1_D0_P (bidir, see [14] 1ST_AP1302 ISP[7B]), AR1_D1_N (bidir, see [14] 1ST_AP1302 ISP[7C]), AR1_D1_P (bidir, see [14] 1ST_AP1302 ISP[7B]), AR2_CLK_N (bidir, see [15] 2ND_AP1302 ISP[7B]), AR2_CLK_P (bidir, see [15] 2ND_AP1302 ISP[7B]), AR2_D0_N (bidir, see [15] 2ND_AP1302 ISP[7B]), AR2_D0_P (bidir, see [15] 2ND_AP1302 ISP[7B]), AR2_D1_N (bidir, see [15] 2ND_AP1302 ISP[7B]), AR2_D1_P (bidir, see [15] 2ND_AP1302 ISP[7B]), AR3_D0_N (bidir, see [15] 2ND_AP1302 ISP[7B]), AR3_D0_P (bidir, see [15] 2ND_AP1302 ISP[7B]), AR3_D1_N (bidir, see [15] 2ND_AP1302 ISP[7C]), AR3_D1_P (bidir, see [15] 2ND_AP1302 ISP[7B]), AR3_LK_N (bidir, see [15] 2ND_AP1302 ISP[7B]), AR3_LK_P (bidir, see [15] 2ND_AP1302 ISP[7B])

### Nets
+1.2V: P9.23 P9.24 P10.23 P10.24 P15.23 P15.24 P16.23 P16.24
+1.8V: P9.13 P10.13 P15.13 P16.13
+2.8V: P9.17 P9.18 P10.17 P10.18 P15.17 P15.18 P16.17 P16.18 R87.2 R89.2
GND: D28.5(GND) D28.10(GND) D29.5(GND) D29.10(GND) D30.3(A) D31.3(A) D32.3(A) D33.5(GND) D33.10(GND) D34.5(GND) D34.10(GND) D35.3(A) D36.3(A) D37.3(A) P9.2 P9.3 P9.6 P9.9 P9.12 P9.16 P9.19 P9.25 P9.28 P9.31 P9.33 P9.P1 P9.P2 P9.P3 P9.P4 P10.2 P10.3 P10.6 P10.9 P10.12 P10.16 P10.19 P10.25 P10.28 P10.31 P10.33 P10.P1 P10.P2 P10.P3 P10.P4 P11.1 P12.1 P13.1 P14.1 P15.2 P15.3 P15.6 P15.9 P15.12 P15.16 P15.19 P15.25 P15.28 P15.31 P15.33 P15.P1 P15.P2 P15.P3 P15.P4 P16.2 P16.3 P16.6 P16.9 P16.12 P16.16 P16.19 P16.25 P16.28 P16.31 P16.33 P16.P1 P16.P2 P16.P3 P16.P4 P17.1 P18.1 P19.1 P20.1 R88.2 R90.2
AP0_EXTCLK: D31.1(K1) P9.32 P10.32 ; port AP0_EXTCLK
AP0_FRAMESYNC: D32.1(K1) P9.20 P10.20 ; port AP0_FRAMESYNC
AP0_RESET: D31.2(K2) P9.21 P10.21 ; port AP0_RESET
AP0_SCL: D30.2(K2) P9.14 P10.14 ; port AP0_SCL
AP0_SDA: D30.1(K1) P9.22 P10.22 ; port AP0_SDA
AP1_EXTCLK: D36.1(K1) P15.32 P16.32 ; port AP1_EXTCLK
AP1_FRAMESYNC: D37.1(K1) P15.20 P16.20 ; port AP1_FRAMESYNC
AP1_RESET: D36.2(K2) P15.21 P16.21 ; port AP1_RESET
AP1_SCL: D35.2(K2) P15.14 P16.14 ; port AP1_SCL
AP1_SDA: D35.1(K1) P15.22 P16.22 ; port AP1_SDA
AR0_CLK_N: D28.2(NC) D28.13(D1-) P9.8 ; port AR0_CLK_N
AR0_CLK_P: D28.1(NC) D28.14(D1+) P9.7 ; port AR0_CLK_P
AR0_D0_N: D28.4(NC) D28.11(D2-) P9.5 ; port AR0_D0_N
AR0_D0_P: D28.3(NC) D28.12(D2+) P9.4 ; port AR0_D0_P
AR0_D1_N: D28.7(NC) D28.8(D3-) P9.29 ; port AR0_D1_N
AR0_D1_P: D28.6(NC) D28.9(D3+) P9.30 ; port AR0_D1_P
AR1_CLK_N: D29.2(NC) D29.13(D1-) P10.8 ; port AR1_CLK_N
AR1_CLK_P: D29.1(NC) D29.14(D1+) P10.7 ; port AR1_CLK_P
AR1_D0_N: D29.4(NC) D29.11(D2-) P10.5 ; port AR1_D0_N
AR1_D0_P: D29.3(NC) D29.12(D2+) P10.4 ; port AR1_D0_P
AR1_D1_N: D29.7(NC) D29.8(D3-) P10.29 ; port AR1_D1_N
AR1_D1_P: D29.6(NC) D29.9(D3+) P10.30 ; port AR1_D1_P
AR2_CLK_N: D33.2(NC) D33.13(D1-) P15.8 ; port AR2_CLK_N
AR2_CLK_P: D33.1(NC) D33.14(D1+) P15.7 ; port AR2_CLK_P
AR2_D0_N: D33.4(NC) D33.11(D2-) P15.5 ; port AR2_D0_N
AR2_D0_P: D33.3(NC) D33.12(D2+) P15.4 ; port AR2_D0_P
AR2_D1_N: D33.7(NC) D33.8(D3-) P15.29 ; port AR2_D1_N
AR2_D1_P: D33.6(NC) D33.9(D3+) P15.30 ; port AR2_D1_P
AR3_D0_N: D34.4(NC) D34.11(D2-) P16.5 ; port AR3_D0_N
AR3_D0_P: D34.3(NC) D34.12(D2+) P16.4 ; port AR3_D0_P
AR3_D1_N: D34.7(NC) D34.8(D3-) P16.29 ; port AR3_D1_N
AR3_D1_P: D34.6(NC) D34.9(D3+) P16.30 ; port AR3_D1_P
AR3_LK_N: D34.2(NC) D34.13(D1-) P16.8 ; port AR3_LK_N
AR3_LK_P: D34.1(NC) D34.14(D1+) P16.7 ; port AR3_LK_P
NetP9_1: P9.1 TP2.1(TP)
NetP9_34: P9.34 R87.1
NetP10_1: P10.1 TP5.1(TP)
NetP10_34: P10.34 R88.1
NetP15_1: P15.1 TP12.1(TP)
NetP15_34: P15.34 R89.1
NetP16_1: P16.1 TP13.1(TP)
NetP16_34: P16.34 R90.1

Not connected (* = marked no-connect by the designer): D32 2(K2)*; D37 2(K2)*; P9 10* 11* 15* 26 27; P10 10* 11* 15* 26 27; P15 10* 11* 15* 26 27; P16 10* 11* 15* 26 27

### Notes on the sheet
- Title:
- Project:
- Draw:
- Check:
- Revision:
- Sheet:
- of
- ©2020
- File Name:
- Size:
- A3
- Modified Date:
- Time:
- Date:

### Library data of the parts
D28 D29 D33 D34 = TPD6E05U06RVZR_symbol: ESD Suppressor Diode Array ±15kV@Air Gap/±12kV@Contact Disc 14-Pin UQFN T/R; Manufacturer 1: Texas Instruments; Direction: Unidirectional; Number of Bidirectional Channels: 6; Reverse Standoff Voltage: 5.5V; Min Breakdown Voltage: 6V; Clamping Voltage: 14V; Peak Pulse Power: 40W; Power Line Protection: Yes; Polarity: Bidirectional; Leakage Current: 10nA; Peak Pulse Current: 2.5A; Interface: LVDS,USB,Ethernet,HDMI,PCIe,SATA; Supplier 1: Digi-Key; Manufacturer Part Number 1: TPD6E05U06RVZR; Stock 1: 0; Pricing 1: 1=0.93000, 10=0.81900, 100=0.62750, 500=0.49608, 1000=0.40950 (USD); RoHS: Yes; Mount: Surface Mount; Number of Pins: 14; Min Operating Temperature: -40°C; Max Operating Temperature: 125°C; Packaging: Tape and Reel; Package Quantity: 3000; Number of Channels: 6; Breakdown Voltage: 6V; Termination: SMD/SMT; Max Power Dissipation: 40W; Working Voltage: 5.5V; Length: 3.6mm; Depth: 1.45mm; Radiation Hardening: No; Lead Free: Lead Free; RoHS Compliant: Yes; ComponentLink1URL: https://datasheet.ciiva.com/29883/tpd6e05u06-29883847.pdf?src-supplier=Avnet; ComponentLink1Description: https://datasheet.ciiva.com/29883/tpd6e05u06-29883847.pdf?src-supplier=Avnet; ComponentLink2URL: https://datasheet.ciiva.com/26918/getdatasheetpartid-747210-26918045.pdf?src-supplier=Verical; ComponentLink2Description: https://datasheet.ciiva.com/26918/getdatasheetpartid-747210-26918045.pdf?src-supplier=Verical; Supplier Part Number 1: 296-39349-6-ND
D30-D32 D35-D37 = CMP-00699-1: TVS DIODE 3V 8V SOT23-3; Manufacturer 1: ON Semiconductor; Peak Pulse Power: 24W; Test Current: 20mA; Breakdown Voltage: 5.32V; ESD Protection: Yes; Number of Unidirectional Channels: 2; Element Configuration: Common Anode; Polarity: Unidirectional; Max Breakdown Voltage: 5.88V; Leakage Current: 5uA; Direction: Unidirectional,Bidirectional; Power Line Protection: No; Max Surge Current: 3A; Composition: Zener; Max Power Dissipation: 24W; Case/Package: SOT-23-3; Number of Pins: 3; Termination: SMD/SMT; Packaging: Tape and Reel; Min Operating Temperature: -55°C; Depth: 1.3mm; Number of Channels: 2; Reverse Standoff Voltage: 3V; Working Voltage: 3V; Manufacturer Part Number 1: SZMMBZ5V6ALT1G; Clamping Voltage: 8V; Max Reverse Leakage Current: 5uA; Lead Free: Lead Free; Power Dissipation: 24W; Height: 1.01mm; Width: 1.4mm; Min Breakdown Voltage: 5.32V; Package Quantity: 1; Radiation Hardening: No; Max Operating Temperature: 150°C; Operating Supply Voltage: 3V; Peak Pulse Current: 3A; Length: 2.9mm
P9 P10 P15 P16 = BM20B(0.8)-34DP-0.4V(51): Board to Board & Mezzanine Connectors 34P DR RCP B2B/B2FPC 0.8mm H 0.4mm P VSMT; Manufacturer: Hirose; Package: None; Value: BM20B(0.8)-34DS-0.4V(53); Availability: Unavailable; Price: None; MP: BM20B(0.8)-34DS-0.4V(53); Supplier 1: Mouser; Manufacturer Part Number: BM20B(0.8)-34DS-0.4V(53); RoHS: Yes; Category: Headers and Wire Housings; Stock 1: 1896; Pricing 1: 1=1.46000, 10=1.22000, 50=1.22000, 100=1.14000, 250=1.03000, 500=0.94500, 1000=0.80900, 2000=0.75500, 5000=0.71800, 10000=0.70100 (USD); ComponentLink1URL: https://datasheet.ciiva.com/29164/en-bm20-20130409-29164303.pdf?src-supplier=Digi-Key; ComponentLink1Description: https://datasheet.ciiva.com/29164/en-bm20-20130409-29164303.pdf?src-supplier=Digi-Key; Supplier Part Number 1: 798-BM20B0834DS04V53
P11-P14 P17-P20 = 9774010243R: Spacer Material: Steel, Tin-Plated Mounting: SMT Series: WA-SMST Thread D: M2; Manufacturer 1: Wurth Electronics; Plating: Tin; Threaded/Unthreaded: Threaded; Outside Diameter: 0.171inch; Manufacturer Part Number 1: 9774010243R; Supplier 1: Digi-Key; Supplier Part Number 1: 732-7065-1-ND; RoHS: Yes; Category: Spacers, Standoffs; Stock 1: 29568; Pricing 1: 1=1.13000, 10=1.06600, 50=0.95000, 100=0.86900, 500=0.81100 (USD); Material: Steel; Length: 0.095inch; REACH SVHC: Unknown; ComponentLink1URL: http://www.farnell.com/datasheets/1960359.pdf?src-supplier=Farnell; ComponentLink1Description: http://www.farnell.com/datasheets/1960359.pdf?src-supplier=Farnell; ComponentLink2URL: https://media.digikey.com/pdf/Data%20Sheets/Wurth%20Electronics%20PDFs/WA-SMSx_Performance_Flyer.pdf?src-supplier=Digi-Key; ComponentLink2Description: https://media.digikey.com/pdf/Data%20Sheets/Wurth%20Electronics%20PDFs/WA-SMSx_Performance_Flyer.pdf?src-supplier=Digi-Key; ComponentLink3URL: http://www.mouser.com/ds/2/445/9774010243R-611450.pdf?src-supplier=Mouser; ComponentLink3Description: http://www.mouser.com/ds/2/445/9774010243R-611450.pdf?src-supplier=Mouser; ComponentLink4URL: http://www.farnell.com/datasheets/1960359.pdf?src-supplier=Element14; ComponentLink4Description: http://www.farnell.com/datasheets/1960359.pdf?src-supplier=Element14; ComponentLink5URL: http://www.farnell.com/datasheets/1960359.pdf?src-supplier=Newark; ComponentLink5Description: http://www.farnell.com/datasheets/1960359.pdf?src-supplier=Newark
P22-P29 = DIN916: Hexagon socket set screws with cup point; Manufacturer Part Number 1: DIN916; Manufacturer 1: N/A
R87-R90 = RES_SMD: RES SMD 10K OHM 1% 1/16W 0402; Manufacturer: Yageo; Manufacturer Part Number: RC0402FR-0710KL; Temperature Coefficient: 100ppm/°C; Voltage Rating (DC): 50V; Power Rating: 62.5mW; Supplier 1: Digi-Key; Supplier Part Number 1: 311-10.0KLRTR-ND; Stock 1: 58760000; Pricing 1: 10000 = 0.001630, 30000 = 0.001440, 50000 = 0.001320, 100000 = 0.001290 (USD); RoHS: Yes; Case/Package: 0402; Number of Pins: 2; Case Code (Imperial): 0402; Case Code (Metric): 1005; Min Operating Temperature: -55°C; Max Operating Temperature: 155°C; Composition: Thick Film; Tolerance: 1%; Packaging: Tape and Reel; Voltage Rating: 50V; Termination: SMD/SMT; Military Standard: Not; Working Voltage: 50V; Number of Terminations: 2; Length: 1mm; Height: 0.32mm; Width: 0.5mm; Depth: 0.5mm; Lead Pitch: 0.2mm; REACH SVHC: No SVHC; Lead Free: Lead Free; ComponentLink1URL: https://datasheet.ciiva.com/7660/38568-7660787.pdf?src-supplier=Element14; ComponentLink1Description: https://datasheet.ciiva.com/7660/38568-7660787.pdf?src-supplier=Element14; ComponentLink2URL: https://datasheet.ciiva.com/7849/1784430-7849813.pdf?src-supplier=Element14; ComponentLink2Description: https://datasheet.ciiva.com/7849/1784430-7849813.pdf?src-supplier=Element14; ComponentLink3URL: https://datasheet.ciiva.com/7849/1686128-7849814.pdf?src-supplier=Element14; ComponentLink3Description: https://datasheet.ciiva.com/7849/1686128-7849814.pdf?src-supplier=Element14; ComponentLink4URL: https://datasheet.ciiva.com/7849/1784430-7849815.pdf?src-supplier=Element14; ComponentLink4Description: https://datasheet.ciiva.com/7849/1784430-7849815.pdf?src-supplier=Element14; ComponentLink5URL: https://datasheet.ciiva.com/22747/1018594-22747512.pdf?src-supplier=Element14; ComponentLink5Description: https://datasheet.ciiva.com/22747/1018594-22747512.pdf?src-supplier=Element14; ComponentLink6URL: https://datasheet.ciiva.com/12667/pyu-rc0402-51-rohs-l-6-r-12667067.pdf?src-supplier=Mouser; ComponentLink6Description: https://datasheet.ciiva.com/12667/pyu-rc0402-51-rohs-l-6-r-12667067.pdf?src-supplier=Mouser; ComponentLink7URL: https://datasheet.ciiva.com/7983/1018594-7983486.pdf?src-supplier=Element14; ComponentLink7Description: https://datasheet.ciiva.com/7983/1018594-7983486.pdf?src-supplier=Element14
TP2 TP5 TP12 TP13 = TestPoint